# EAGLE design semistatic (EAGLE 9.6.2)
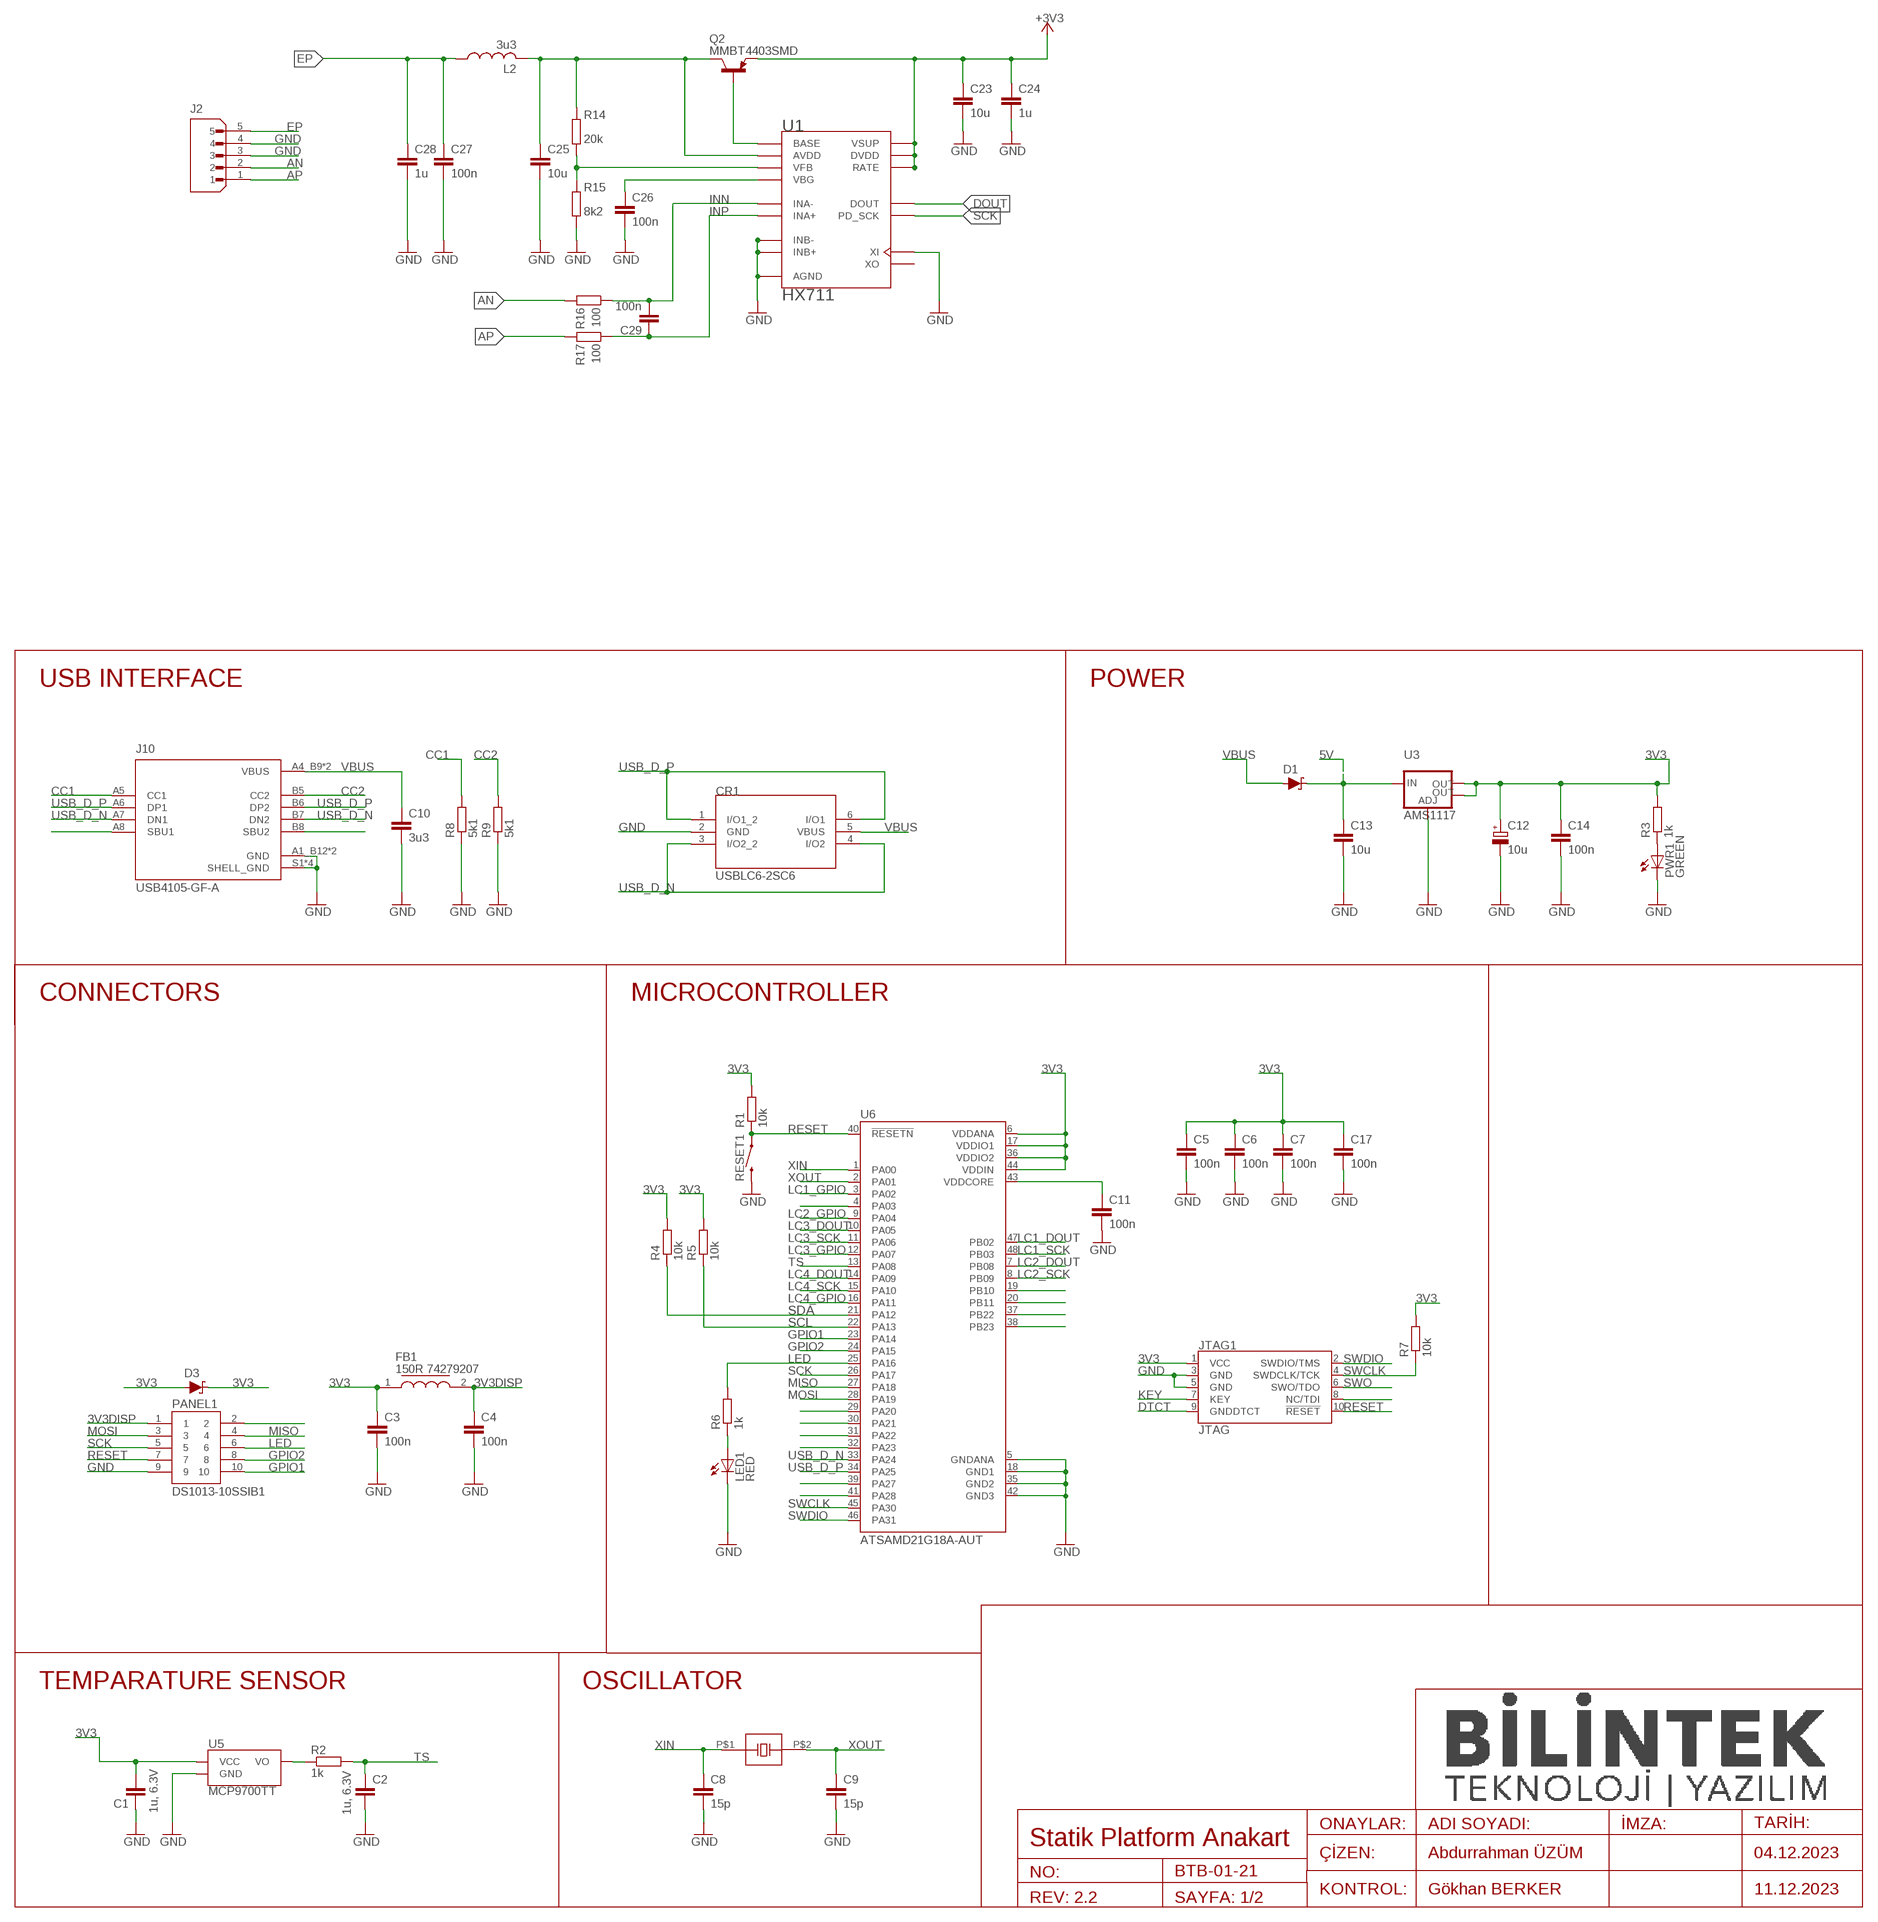
[diagram p0: schematic, sheet 1, part 1 of 2]
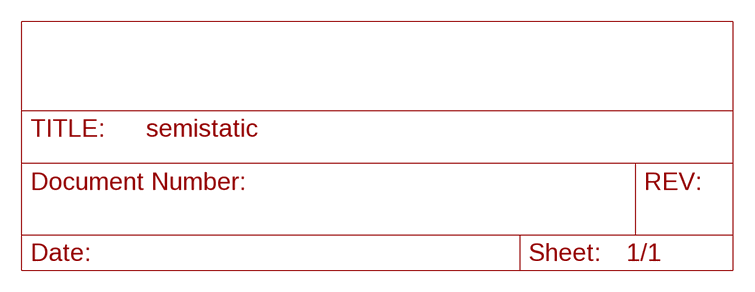
[diagram p1: schematic, sheet 1, part 2 of 2]

## Parts
C1  1u, 6.3V  C-EUC0603  [C0603]
C2  1u, 6.3V  C-EUC0603  [C0603]
C3  100n  C-EUC0603  [C0603]
C4  100n  C-EUC0603  [C0603]
C5  100n  C-EUC0603  [C0603]
C6  100n  C-EUC0603  [C0603]
C7  100n  C-EUC0603  [C0603]
C8  15p  C-EUC0603  [C0603]
C9  15p  C-EUC0603  [C0603]
C10  3u3  C-EUC0603K  [C0603K]
C11  100n  C-EUC0603  [C0603]
C12  10u  CPOL-EUD  [PANASONIC_D]
C13  10u  C-EUC0603  [C0603]
C14  100n  C-EUC0603  [C0603]
C17  100n  C-EUC0603  [C0603]
C23  10u  C-EUC0603  [C0603]
C24  1u  C-EUC0603  [C0603]
C25  10u  C-EUC0603  [C0603]
C26  100n  C-EUC0603  [C0603]
C27  100n  C-EUC0603  [C0603]
C28  1u  C-EUC0603  [C0603]
C29  100n  C-EUC0603  [C0603]
CR1  USBLC6-2SC6  [SOT23-6L_STM]
D1  3A/10V/280mV  DIODE-SCHOTTKY-BAT60A  [SOD-323]
D3  3A/10V/280mV  DIODE-SCHOTTKY-BAT60A  [SOD-323]
FB1  150R 74279207  74279207  [CAPC2012X90N]
J2  B5B-XH-A(LF)(SN)  [JST_B5B-XH-A(LF)(SN)]
J10  USB4105-GF-A  [GCT_USB4105-GF-A]
JTAG1  JTAG  CORTEX_DEBUG_SMD  [SAMTECH_FTSH-105-01]
L2  3u3  L-USL3216C  [L3216C]
LED1  RED  LEDCHIPLED_0805  [CHIPLED_0805]
PANEL1  DS1013-10SSIB1  [CONNFLY_DS1013-10SSIB1]
PWR1  GREEN  LEDCHIPLED_0805  [CHIPLED_0805]
Q2  MMBT4403SMD  [SOT23-BEC]
R1  10k  R-EU_R0603  [R0603]
R2  1k  R-EU_R0603  [R0603]
R3  1k  R-EU_R0603  [R0603]
R4  10k  R-EU_R0603  [R0603]
R5  10k  R-EU_R0603  [R0603]
R6  1k  R-EU_R0603  [R0603]
R7  10k  R-EU_R0603  [R0603]
R8  5k1  R-EU_R0603  [R0603]
R9  5k1  R-EU_R0603  [R0603]
R14  20k  R-EU_R0603  [R0603]
R15  8k2  R-EU_R0603  [R0603]
R16  100  R-EU_R0603  [R0603]
R17  100  R-EU_R0603  [R0603]
RESET1  MOMENTARY-SWITCH-SPST-SMD-6.0X3.5MM  [TACTILE_SWITCH_SMD_6.0X3.5MM]
U1  HX711  [SOP127P600X180-16N]
U3  AMS1117  V_REG_LM1117SOT223  [SOT223]
U5  MCP9700TT  [SOT23-3]
U6  ATSAMD21G18A-AUT  [QFP50P900X900X120-48N]
Y2  32728  CRYSTALSAMD  [CRYSTALSAMD]

## Nets
3V3: C1.2 C3.1 C5.1 C6.1 C7.1 C12.+ C14.1 C17.1 D3.A D3.C FB1.1 JTAG1.1(VCC) R1.2 R3.2 R4.2 R5.2 R7.2 U3.2(OUT) U3.4(OUT) U5.1(VCC) U6.6(VDDANA) U6.17(VDDIO1) U6.36(VDDIO2) U6.44(VDDIN)
3V3DISP: C4.1 FB1.2 PANEL1.1
5V: C13.1 D1.C U3.3(IN)
+3V3: C23.1 C24.1 Q2.E U1.1(VSUP) U1.15(RATE) U1.16(DVDD)
AN: J2.2 R16.2
AP: J2.1 R17.2
AVDD1: C25.1 L2.2 Q2.C R14.1 U1.3(AVDD)
BASE1: Q2.B U1.2(BASE)
CC1: J10.A5(CC1) R8.2
CC2: J10.B5(CC2) R9.2
DOUT: U1.12(DOUT)
DTCT: JTAG1.9(GNDDTCT)
EP: C27.1 C28.1 J2.5 L2.1
GND: C1.1 C2.2 C3.2 C4.2 C5.2 C6.2 C7.2 C8.2 C9.2 C10.2 C11.2 C12.- C13.2 C14.2 C17.2 C23.2 C24.2 C25.2 C26.2 C27.2 C28.2 CR1.2(GND) J2.3 J2.4 J10.A1_B12(GND) J10.B1_A12(GND) J10.S1(SHELL_GND) J10.S2(SHELL_GND) J10.S3(SHELL_GND) J10.S4(SHELL_GND) JTAG1.3(GND) JTAG1.5(GND) LED1.C PANEL1.9 PWR1.C R8.1 R9.1 R15.2 RESET1.2 U1.5(AGND) U1.9(INB-) U1.10(INB+) U1.14(XI) U3.1(ADJ) U5.3(GND) U6.5(GNDANA) U6.18(GND1) U6.35(GND2) U6.42(GND3)
GPIO1: PANEL1.10 U6.23(PA14)
GPIO2: PANEL1.8 U6.24(PA15)
INN: C29.2 R16.1 U1.7(INA-)
INP: C29.1 R17.1 U1.8(INA+)
KEY: JTAG1.7(KEY)
LC1_DOUT: U6.47(PB02)
LC1_GPIO: U6.3(PA02)
LC1_SCK: U6.48(PB03)
LC2_DOUT: U6.7(PB08)
LC2_GPIO: U6.9(PA04)
LC2_SCK: U6.8(PB09)
LC3_DOUT: U6.10(PA05)
LC3_GPIO: U6.12(PA07)
LC3_SCK: U6.11(PA06)
LC4_DOUT: U6.14(PA09)
LC4_GPIO: U6.16(PA11)
LC4_SCK: U6.15(PA10)
LED: PANEL1.6 R6.2 U6.25(PA16)
LED_GP2: LED1.A R6.1
LED_PWR1: PWR1.A R3.1
MISO: PANEL1.4 U6.27(PA18)
MOSI: PANEL1.3 U6.28(PA19)
N$4: R2.1 U5.2(VO)
N$5: U6.4(PA03)
N$6: U6.29(PA20)
N$10: U6.39(PA27)
N$11: U6.41(PA28)
N$12: U6.19(PB10)
N$13: U6.20(PB11)
N$14: U6.37(PB22)
N$15: U6.38(PB23)
N$16: J10.A8(SBU1)
N$17: J10.B8(SBU2)
N$18: JTAG1.8(NC/TDI)
N$21: PANEL1.2
N$22: U6.30(PA21)
N$23: U6.31(PA22)
N$25: U6.32(PA23)
RESET: JTAG1.10(!RESET) PANEL1.7 R1.1 RESET1.1 U6.40(!RESETN)
SCK: PANEL1.5 U1.11(PD_SCK) U6.26(PA17)
SCL: R5.1 U6.22(PA13)
SDA: R4.1 U6.21(PA12)
SWCLK: JTAG1.4(SWDCLK/TCK) R7.1 U6.45(PA30)
SWDIO: JTAG1.2(SWDIO/TMS) U6.46(PA31)
SWO: JTAG1.6(SWO/TDO)
TS: C2.1 R2.2 U6.13(PA08)
USB_D_N [usbpair]: CR1.3(I/O2_2) CR1.4(I/O2) J10.A7(DN1) J10.B7(DN2) U6.33(PA24)
USB_D_P [usbpair]: CR1.1(I/O1_2) CR1.6(I/O1) J10.A6(DP1) J10.B6(DP2) U6.34(PA25)
VBG1: C26.1 U1.6(VBG)
VBUS: C10.1 CR1.5(VBUS) D1.A J10.A4_B9(VBUS) J10.B4_A9(VBUS)
VDDCORE1: C11.1 U6.43(VDDCORE)
VFB1: R14.2 R15.1 U1.4(VFB)
XIN: C8.1 U6.1(PA00) Y2.P$1(XIN)
XOUT: C9.1 U6.2(PA01) Y2.P$2(XOUT)
Unconnected: U1.13(XO)

## Notes on the sheet
- USB INTERFACE | POWER
- CONNECTORS | MICROCONTROLLER
- TEMPARATURE SENSOR | OSCILLATOR
- ONAYLAR: | ADI SOYADI: | İMZA: | TARİH:
- Statik Platform Anakart
- ÇİZEN: | Abdurrahman ÜZÜM | 04.12.2023
- NO: | BTB-01-21
- KONTROL: | Gökhan BERKER | 11.12.2023
- REV: 2.2 | SAYFA: 1/2

## Library data of the parts
C1-C11 C13 C14 C17 C23-C29 = rcl:C-EU: CAPACITOR, European symbol; SPICEPREFIX: C
C12 = rcl:CPOL-EU: POLARIZED CAPACITOR, European symbol; SPICEPREFIX: C
CR1 = usblc6:USBLC6-2SC6; COPYRIGHT: Copyright (C) 2023 Ultra Librarian. All rights reserved.; MANUFACTURER_PART_NUMBER: USBLC6-2SC6; MFR_NAME: STMicroelectronics
D1 D3 = SparkFun-DiscreteSemi:DIODE-SCHOTTKY: Schottky diode A Schottky diode is a semiconductor diode which has a low forward voltage drop and a very fast switching action.; PROD_ID: DIO-14072
FB1 = FB_74279207:74279207: SMD EMI Suppression Ferrite Beads WE-CBF Source: Datasheet; DESCRIPTION: SMD EMI Suppression Ferrite Beads WE-CBF; HEIGHT: 0.9mm; MANUFACTURER_NAME: Wurth Elektronik; MANUFACTURER_PART_NUMBER: 74279207; MOUSER_PART_NUMBER: 710-74279207; MOUSER_PRICE-STOCK: https://www.mouser.co.uk/ProductDetail/Wurth-Elektronik/74279207?qs=Wn16VcyqZWrAx3dDPZmCbQ%3D%3D
J2 = B5B-XH-A_LF__SN_:B5B-XH-A(LF)(SN): Check availability <https://pricing.snapeda.com/parts/B5B-XH-A%28LF%29%28SN%29/JST%20Sales%20America%20Inc./view-part?ref=eda>; AVAILABILITY: In Stock; DESCRIPTION: Connector Header Through Hole 5 position 0.098 (2.50mm); MF: JST Sales America Inc.; MP: B5B-XH-A(LF)(SN); PACKAGE: None; PRICE: None; PURCHASE-URL: https://pricing.snapeda.com/search/part/B5B-XH-A(LF)(SN)/?ref=eda
J10 = USB4105-GF-A:USB4105-GF-A: USB-C (USB TYPE-C) USB 2.0 Receptacle Connector 24 (16+8 Dummy) Position Surface Mount, Right Angle; Through Hole Check availability <https://pricing.snapeda.com/parts/USB4105-GF-A/GCT/view-part?ref=eda>; AVAILABILITY: In Stock; DESCRIPTION: USB-C (USB TYPE-C) USB 2.0 Receptacle Connector 24 (16+8 Dummy) Position Surface Mount, Right Angle; Through Hole; MF: GCT; MP: USB4105-GF-A; PACKAGE: None; PRICE: None; PURCHASE-URL: https://pricing.snapeda.com/search?q=USB4105-GF-A&ref=eda
JTAG1 = SparkFun-Connectors:CORTEX_DEBUG: Cortex Debug Connector - 10 pin Supports JTAG debug, Serial Wire debug, and Serial Wire Viewer. PTH and SMD connector options available. General Connector Information <http://infocenter.arm.com/help/topic/com.arm.doc.faqs/attached/13634/cortex_debug_connectors.pdf> Products: PTH Connector <http://www.digikey.com/product-detail/en/cnc-tech/3220-10-0100-00/1175-1627-ND/3883661> -via Digi-Key SparkFun PSoc <https://www.sparkfun.com/products/13229> SparkFun T <https://www.sparkfun.com/products/13810>
L2 = rcl:L-US: INDUCTOR, American symbol; SPICEPREFIX: L
LED1 PWR1 = adafruit:LED: LED OSRAM: - CHIPLED LG R971, LG N971, LY N971, LG Q971, LY Q971, LO R971, LY R971 LH N974, LH R974 LS Q976, LO Q976, LY Q976 LO Q996 - Hyper CHIPLED LW Q18S LB Q993, LB Q99A, LB R99A - SideLED LS A670, LO A670, LY A670, LG A670, LP A670 LB A673, LV A673, LT A673, LW A673 LH A674 LY A675 LS A676, LA A676, LO A676, LY A676, LW A676 LS A679, LY A679, LG A679 - Hyper Micro SIDELED® LS Y876, LA Y876, LO Y876, LY Y876 LT Y87S - SmartLED LW L88C, LW L88S LB L89C, LB L89S, LG L890 LS L89K, LO L89K, LY L89K LS L896, LA L896, LO L896, LY L896 - TOPLED LS T670, LO T670, LY T670, LG T670, LP T670 LSG T670, LSP T670, LSY T670, LOP T670, LYG T670 LG T671, LOG T671, LSG T671 LB T673, LV T673, LT T673, LW T673 LH T674 LS T676, LA T676, LO T676, LY T676, LB T676, LH T676, LSB T676, LW T676 LB T67C, LV T67C, LT T67C, LS T67K, LO T67K, LY T67K, LW E67C LS E67B, LA E67B, LO E67B, LY E67B, LB E67C, LV E67C, LT E67C LW T67C LS T679, LY T679, LG T679 LS T770, LO T770, LY T770, LG T770, LP T770 LB T773, LV T773, LT T773, LW T773 LH T774 LS E675, LA E675, LY E675, LS T675 LS T776, LA T776, LO T776, LY T776, LB T776 LHGB T686 LT T68C, LB T68C - Hyper Mini TOPLED® LB M676 - Mini TOPLED Santana® LG M470 LS M47K, LO M47K, LY M47K Source: http://www.osram.convergy.de/
PANEL1 = IDC_CON_DS1013-10SSIB1:DS1013-10SSIB1: Socket; IDC; male; PIN: 10; straight; THT; gold-plated; 2.54mm Check availability <https://pricing.snapeda.com/parts/DS1013-10SSIB1/Connfly/view-part?ref=eda>; AVAILABILITY: Not in stock; DESCRIPTION: Socket; IDC; male; PIN: 10; straight; THT; gold plated; 2.54mm; MF: Connfly; MP: DS1013-10SSIB1; PACKAGE: None; PRICE: None
Q2 = MMBT4403_:MMBT4403*: PNP Transistror Check availability <https://pricing.snapeda.com/parts/MMBT4403/ON%20Semiconductor/view-part?ref=eda>; AVAILABILITY: In Stock; DESCRIPTION: Bipolar (BJT) Transistor PNP 40 V 600 mA 200MHz 150 mW Surface Mount SC-70-3 (SOT323); MF: ON Semiconductor; MP: MMBT4403; PACKAGE: SOT-23-3 ON Semiconductor; PRICE: None; PURCHASE-URL: https://pricing.snapeda.com/search/part/MMBT4403/?ref=eda
R1-R9 R14-R17 = rcl:R-EU_: RESISTOR, European symbol; SPICEPREFIX: R
RESET1 = SparkFun-Switches:MOMENTARY-SWITCH-SPST: Momentary Switch (Pushbutton) - SPST Normally-open (NO) SPST momentary switches (buttons, pushbuttons). Variants PTH-12MM - 12mm square, through-hole Momentary Pushbutton Switch - 12mm Square <https://www.sparkfun.com/products/9190> (COM-09190) PTH-6.0MM, PTH-6.0MM-KIT - 6.0mm square, through-hole Mini Pushbutton Switch <https://www.sparkfun.com/products/97> (COM-00097) KIT package intended for soldering kit's - only one side of pads' copper is exposed. PTH-RIGHT-ANGLE-KIT - Right-angle, through-hole Right Angle Tactile Button <https://www.sparkfun.com/products/10791> - Used on SparkFun BigTime Watch Kit <https://www.sparkfun.com/products/11734> SMD-12MM - 12mm square, surface-mount Tactile Button - SMD (12mm) <https://www.sparkfun.com/products/12993> (COM-12993) Used on SparkFun PicoBoard <https://www.sparkfun.com/products/11888> SMD-4.5MM - 4.5mm Square Trackball Switch Used on SparkFun Blackberry Trackballer Breakout <https://www.sparkfun.com/products/13169> SMD-4.6MMX2.8MM - 4.60mm x 2.80mm, surface mount Used on SparkFun Pro Micro - RP2040 <https://www.sparkfun.com/products/17717> SMD-5.2MM, SMD-5.2-REDUNDANT - 5.2mm square, surface-mount Mini Pushbutton Switch - SMD <https://www.sparkfun.com/products/8720> (COM-08720) Used on Arduino Pro Mini <https://www.sparkfun.com/products/11114> REDUNDANT package connects both switch circuits together SMD-6.0X3.5MM - 6.0 x 3.5mm, surface mount Momentary Reset Switch SMD <https://www.sparkfun.com/products/8229> (COM-08229) SMD-6.2MM-TALL - 6.2mm square, surface mount Tactile Button - SMD (6mm) <https://www.sparkfun.com/products/12992> Used on SparkFun Digital Sandbox <https://www.sparkfun.com/products/12651> SMD-RIGHT-ANGLE - Right-angle, surface mount Used on SparkFun Block for Intel® Edison - Arduino <https://www.sparkfun.com/products/13036>; PROD_ID: SWCH-14278; SF_SKU: COM-08229
U1 = HX711:HX711: Check availability <https://pricing.snapeda.com/parts/HX711/AVIA%20SEMICONDUCTOR/view-part?ref=eda>; AVAILABILITY: Not in stock; DESCRIPTION: Precision 24-bit analog-to-digital converter (ADC) designed for weigh scales and industrial control applications to interface directly with a bridge sensor.; MF: AVIA SEMICONDUCTOR; MP: HX711; PACKAGE: None; PRICE: None
U3 = SparkFun-IC-Power:V_REG_LM1117: Voltage Regulator LM1117 Standard adjustable voltage regulator but in SMD form. Spark Fun Electronics SKU : COM-00595; PROD_ID: VREG-08170
U5 = SparkFun-Sensors:MCP9700: Microchip MCP9700 Analog-Output Temperature Sensor The MCP9700 can accurately measure temperature from -40C to +150C. The output of the MCP9700 is calibrated to a slope of 10mV/°C and has a DC offset of 500mV. The offset allows reading negative temperatures without the need for a negative supply. Datasheet <http://ww1.microchip.com/downloads/en/DeviceDoc/20001942F.pdf> SparkFun Products LilyPad Temperature Sensor <https://www.sparkfun.com/products/8777> (DEV-08777) SparkFun Digital Sandbox <https://www.sparkfun.com/products/12651> (DEV-12651); PROD_ID: IC-08917
U6 = ATSAMD21G18A-AUT:ATSAMD21G18A-AUT: Cortex-M0+, 256KB FLASH, 32KB SRAM, USB, DMA, T&R - 48TQFP IND TEMP, GREEN, 1.6-3.6V, 48MHz Check availability <https://pricing.snapeda.com/parts/ATSAMD21G18A-AUT/Microchip/view-part?ref=eda>; AVAILABILITY: In Stock; DESCRIPTION: ARM® Cortex®-M0+ SAM D21G, Functional Safety (FuSa) Microcontroller IC 32-Bit Single-Core 48MHz 256KB (256K x 8) FLASH 48-TQFP (7x7); MF: Microchip; MP: ATSAMD21G18A-AUT; PACKAGE: TQFP-48 Microchip; PRICE: None; PURCHASE-URL: https://pricing.snapeda.com/search?q=ATSAMD21G18A-AUT&ref=eda
Y2 = crystalsamd:CRYSTALSAMD

## Net classes
1 usbpair: width 0.25 mm, clearance 0.2 mm

## Board
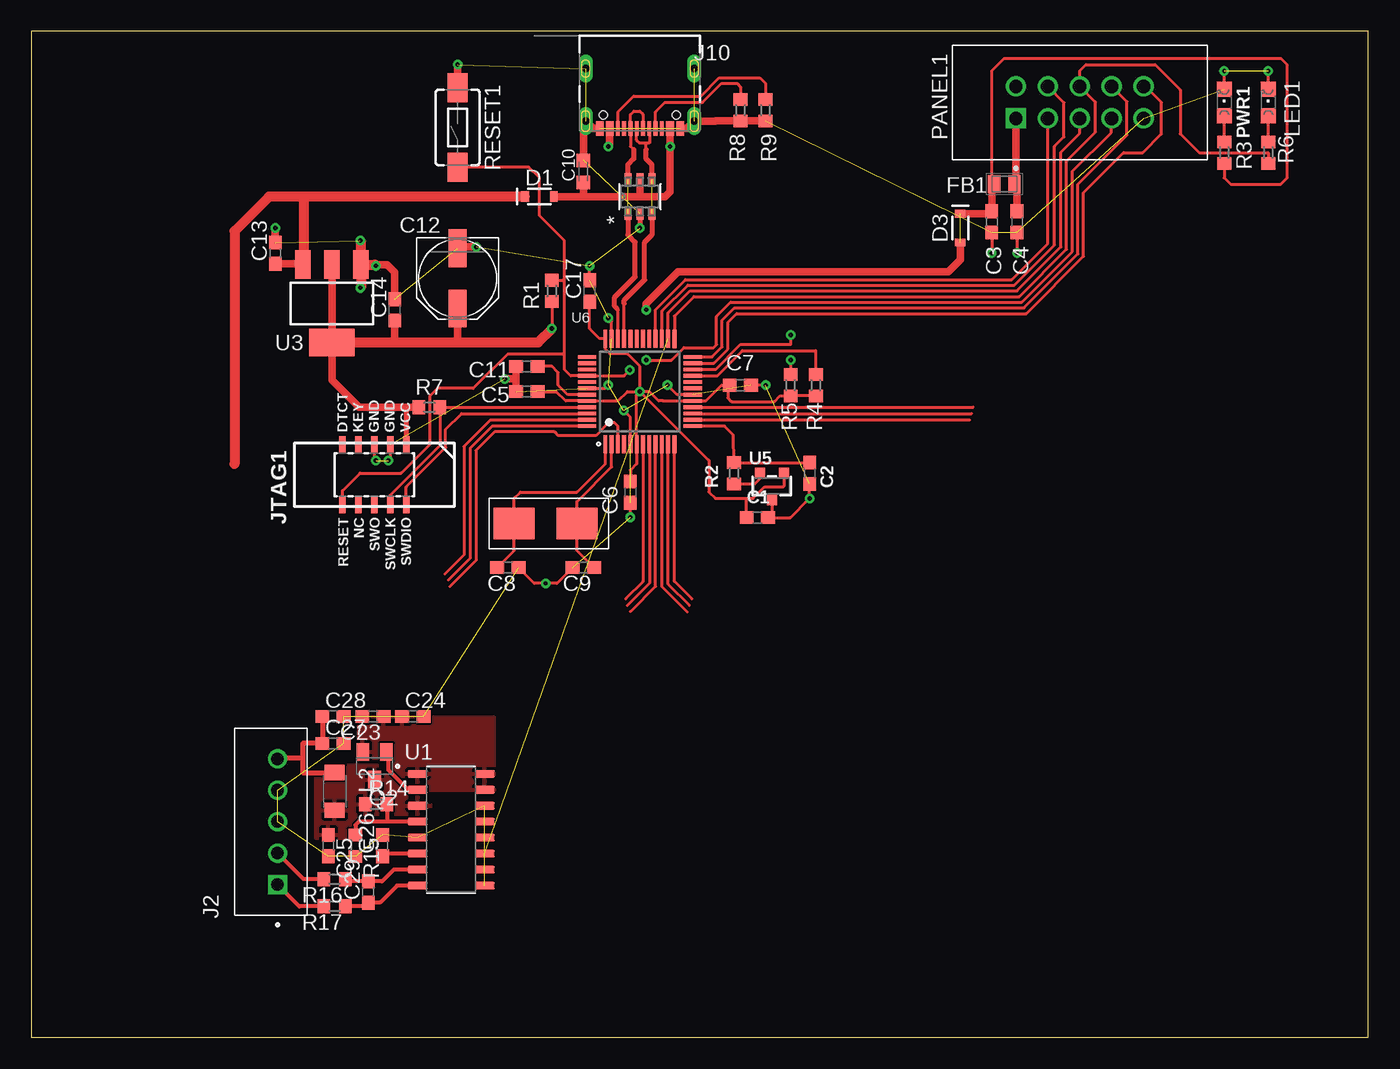
[diagram p2: board, top side]
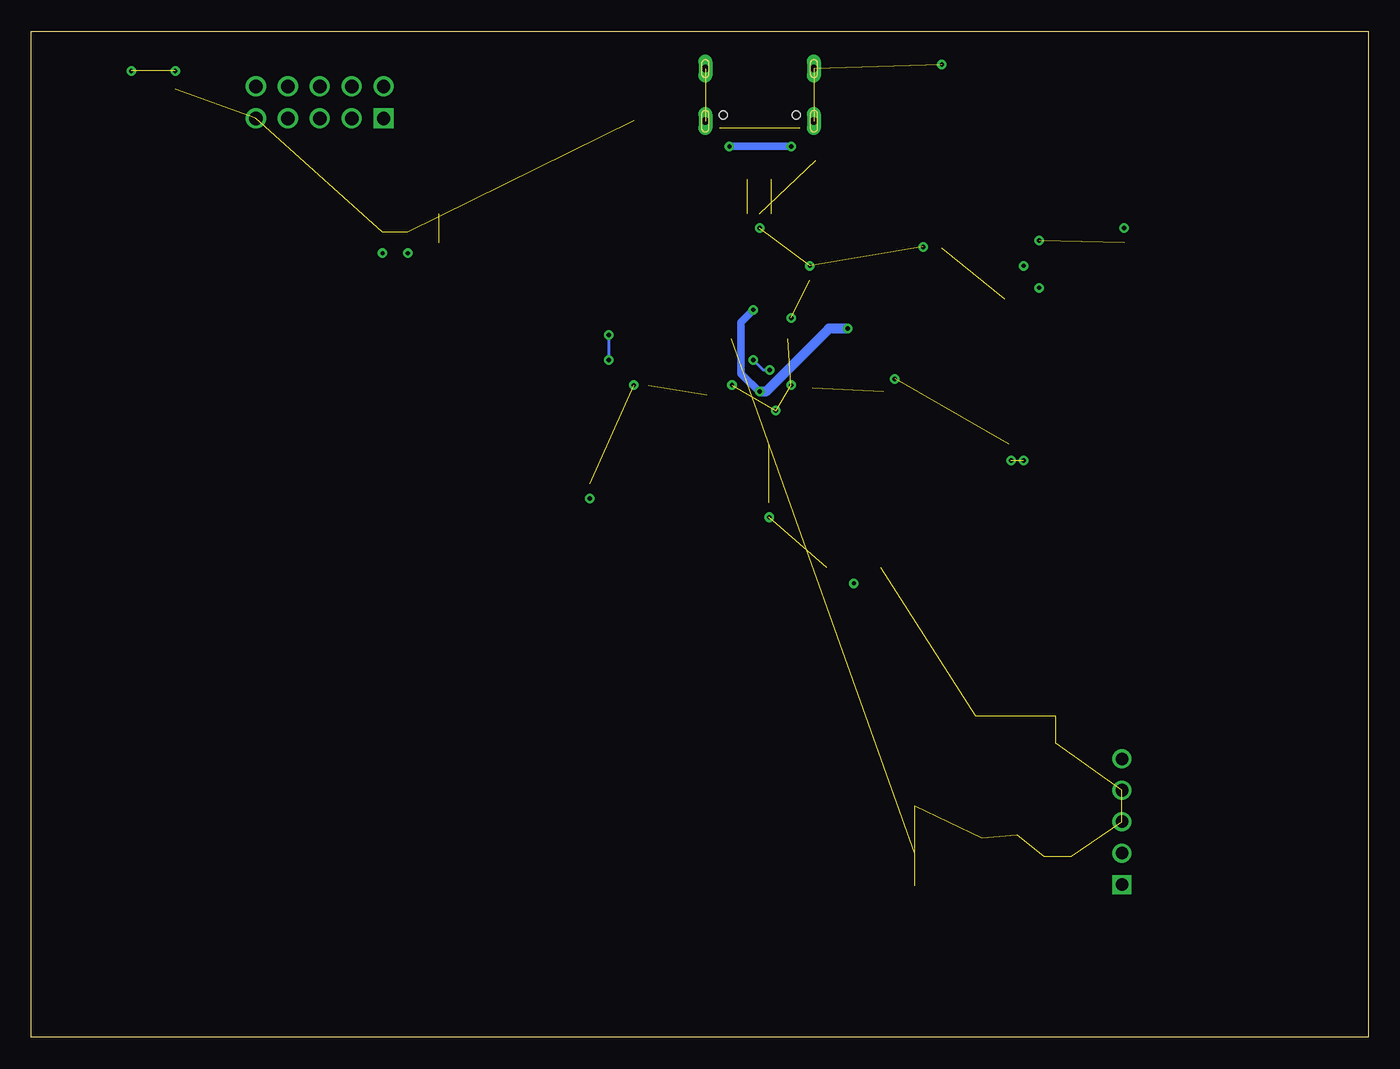
[diagram p3: board, bottom side, seen from below]

Size 106.35 x 80 mm. Coordinates in mm from the lower left corner, seen from the top.
Outline: 0,0 106.35,0 106.35,80 0,80 0,0
Copper layers (1*16): Top 0.035mm / dielectric 1.5mm / Bottom 0.035mm
Design rules "default": minimum track width 6mil, minimum drill 0.35mm, track to track 6mil, track to pad 6mil, pad to pad 6mil, via to via 6mil, smd to smd 6mil, copper to edge 40mil, drill to drill 6mil, minimum pad ring 10mil, minimum via ring 8mil, stop-mask expansion 4mil, vias tented up to drill 0mil, thermal gap 10mil
bRestrict: 7 lines

### Footprints (pad centres in the part's own frame; a part is rotated, then mirrored left to right if it is on the bottom)
C0603 = smd 1.1 x 1: 1 -0.85,0; 2 0.85,0
C0603K = smd 1.05 x 1.08: 1 -0.875,0; 2 0.875,0
PANASONIC_D = smd 3 x 1.4: + 2.4,0; - -2.4,0
SOT23-6L_STM = smd 0.978 x 0.559: 1 -1.365,0.95; 2 -1.365,0; 3 -1.365,-0.95; 4 1.365,-0.95; 5 1.365,0; 6 1.365,0.95
SOD-323 = smd 0.63 x 0.83: A 1.15,0; C -1.15,0
CAPC2012X90N = smd 0.96 x 1.39: 1 -0.81,0; 2 0.81,0
JST_B5B-XH-A(LF)(SN) = drill 1 square: 1 -5,-0.525 | drill 1: 2 -2.5,-0.525; 3 0,-0.525; 4 2.5,-0.525; 5 5,-0.525
GCT_USB4105-GF-A = smd 0.6 x 1.15: A1_B12 -3.2,4.755; A4_B9 -2.4,4.755; B1_A12 3.2,4.755; B4_A9 2.4,4.755 | smd 0.3 x 1.15: A5 -1.25,4.755; A6 -0.25,4.755; A7 0.25,4.755; A8 1.25,4.755; B5 1.75,4.755; B6 0.75,4.755; B7 -0.75,4.755; B8 -1.75,4.755 | drill 0.6 pad 1.05 long: S1 -4.32,4.18; S4 4.32,4.18 | drill 0.6 pad 1 long: S2 -4.32,0; S3 4.32,0 | hole 0.65: -2.9,3.68; 2.9,3.68
SAMTECH_FTSH-105-01 = smd 0.508 x 1.27: 1 -2.54,-2.413; 2 -2.54,2.413; 3 -1.27,-2.413; 4 -1.27,2.413; 5 0,-2.413; 6 0,2.413; 7 1.27,-2.413; 8 1.27,2.413; 9 2.54,-2.413; 10 2.54,2.413
L3216C = smd 1.2 x 1.6: 1 -1.5,0; 2 1.5,0
CHIPLED_0805 = smd 1.2 x 1.2: A 0,-1.05; C 0,1.05
CONNFLY_DS1013-10SSIB1 = drill 1.07 square: 1 -5.08,-1.27 | drill 1.07: 2 -5.08,1.27; 3 -2.54,-1.27; 4 -2.54,1.27; 5 0,-1.27; 6 0,1.27; 7 2.54,-1.27; 8 2.54,1.27; 9 5.08,-1.27; 10 5.08,1.27
SOT23-BEC = smd 1 x 1.4: B -0.95,-1.1; C 0,1.1; E 0.95,-1.1
R0603 = smd 1 x 1.1: 1 -0.85,0; 2 0.85,0
TACTILE_SWITCH_SMD_6.0X3.5MM = smd 2.3 x 1.6: 1 -3.15,0; 2 3.15,0
SOP127P600X180-16N = smd 1.58 x 0.59: 1 -2.67,4.445; 2 -2.67,3.175; 3 -2.67,1.905; 4 -2.67,0.635; 5 -2.67,-0.635; 6 -2.67,-1.905; 7 -2.67,-3.175; 8 -2.67,-4.445; 9 2.67,-4.445; 10 2.67,-3.175; 11 2.67,-1.905; 12 2.67,-0.635; 13 2.67,0.635; 14 2.67,1.905; 15 2.67,3.175; 16 2.67,4.445
SOT223 = smd 1.219 x 2.235: 1 -2.311,-3.099; 2 0,-3.099; 3 2.311,-3.099 | smd 3.6 x 2.2: 4 0,3.099
SOT23-3 = smd 0.8 x 0.9: 1 -0.95,-1; 2 0.95,-1; 3 0,1.1
QFP50P900X900X120-48N = smd 1.45 x 0.3: 1 -4.2,2.75; 2 -4.2,2.25; 3 -4.2,1.75; 4 -4.2,1.25; 5 -4.2,0.75; 6 -4.2,0.25; 7 -4.2,-0.25; 8 -4.2,-0.75; 9 -4.2,-1.25; 10 -4.2,-1.75; 11 -4.2,-2.25; 12 -4.2,-2.75; 25 4.17,-2.75; 26 4.2,-2.25; 27 4.2,-1.75; 28 4.2,-1.25; 29 4.2,-0.75; 30 4.2,-0.25; 31 4.2,0.25; 32 4.2,0.75; 33 4.2,1.25; 34 4.2,1.75; 35 4.2,2.25; 36 4.2,2.75 | smd 0.3 x 1.45: 13 -2.75,-4.2; 14 -2.25,-4.2; 15 -1.75,-4.2; 16 -1.25,-4.2; 17 -0.75,-4.2; 18 -0.25,-4.2; 19 0.25,-4.2; 20 0.75,-4.2; 21 1.25,-4.2; 22 1.75,-4.2; 23 2.25,-4.2; 24 2.75,-4.2; 37 2.75,4.2; 38 2.25,4.2; 39 1.75,4.2; 40 1.25,4.2; 41 0.75,4.2; 42 0.25,4.2; 43 -0.25,4.2; 44 -0.75,4.2; 45 -1.25,4.2; 46 -1.75,4.2; 47 -2.25,4.2; 48 -2.75,4.2
CRYSTALSAMD = smd 3.25 x 2.5: P$1 -2.5,0; P$2 2.5,0

### Placement (x,y rotation side)
C1  57.77,41.33 180 top
C2  61.91,44.86 270 top
C3  76.41,64.86 270 top
C4  78.41,64.86 270 top
C5  39.41,51.36 180 top
C6  47.66,43.36 270 top
C7  56.41,51.86 0 top
C8  37.91,37.36 0 top
C9  43.91,37.36 180 top
C10  43.91,68.86 90 top
C11  39.41,53.36 180 top
C12  33.91,60.36 270 top
C13  19.41,62.36 90 top
C14  28.91,57.86 90 top
C17  44.41,59.36 90 top
C23  27.18,25.53 180 top
C24  30.35,25.53 0 top
C25  23.62,15.24 270 top
C26  27.94,15.24 90 top
C27  24,23.37 0 top
C28  24,25.53 0 top
C29  26.8,11.56 90 top
CR1  48.41,66.86 90 top
D1  40.41,66.86 0 top
D3  73.91,64.36 270 top
FB1  77.41,67.86 0 top
J2  19.05,17.14 90 top
J10  48.41,77.04 180 top
JTAG1  27.29,44.74 180 top
L2  24.13,19.56 270 top
LED1  98.41,74.36 0 top
PANEL1  83.41,74.36 0 top
PWR1  94.91,74.36 0 top
Q2  27.3,21.59 180 top
R1  41.41,59.36 270 top
R2  55.91,44.86 90 top
R3  94.91,70.36 270 top
R4  62.41,51.86 270 top
R5  60.41,51.86 270 top
R6  98.41,70.36 270 top
R7  31.66,50.11 180 top
R8  56.41,73.73 90 top
R9  58.41,73.73 90 top
R14  27.43,18.54 0 top
R15  25.78,15.24 270 top
R16  24.13,12.57 180 top
R17  24.13,10.41 180 top
RESET1  33.91,72.36 90 top
U1  33.4,16.51 0 top
U3  23.91,58.36 180 top
U5  58.91,43.86 180 top
U6  48.41,51.36 90 top
Y2  40.91,40.86 0 top

### Tracks (layer width: path | path; a pad name or v marks a point on that pad's centre or on a via)
3V3  (via drill 0.35)  (1 unrouted)
  Top 0.25: C6.1 47.66,45.11 48.16,45.61 U6.6 48.16,51.11 v48.41,51.36 | U6.17 53.66,50.61 54.91,51.86 C7.1 55.41,51.71 55.41,50.86 55.71,50.56 59.11,50.56 59.56,51.01 R5.2 R4.2 | C5.1 41.76,51.36 42.51,50.61 U6.44 46.66,50.61 47.41,51.36 v48.41,51.36 | 56.91,42.86 54.41,42.86 53.91,43.36 53.91,45.9 53.87,45.9 v48.41,51.36 | 56.91,42.86 57.42,42.86 58.34,43.78 59.84,43.78 59.91,43.86 59.91,44.81 U5.1 | 50.24,50.61 49.91,50.61 49.16,51.36 v48.41,51.36 | v48.41,51.36 48.41,53.36 47.41,54.36 46.02,54.36 45.66,54.73 U6.36 45.21,55.56 44.41,56.36 C17.1 | R3.2 94.91,68.36 95.41,67.86 99.41,67.86 99.91,68.36 99.91,77.36 99.41,77.86 77.41,77.86 76.41,76.86 76.41,67.67 76.41,67.17 | C1.2 56.91,42.86 | R1.2 v41.41,56.36
  Top 0.254: 50.24,50.61 U6.17
  Top 0.406: JTAG1.1 29.83,50.11 R7.2
  Top 0.61: v48.91,57.86 48.91,58.36 51.44,60.89 72.94,60.89 73.91,61.86 D3.A | 76.41,67.17 C3.1 76.21,65.51 D3.C | 76.41,67.67 FB1.1 | U3.2 U3.4 23.91,52.26 26.06,50.11 R7.2 | C14.1 28.91,55.26 | C12.+ 33.91,55.26
  Top 0.813: U3.4 28.91,55.26 33.91,55.26 40.31,55.26 v41.41,56.36
  Bottom 0.61: v48.41,51.36 49.91,52.77 49.91,56.86 v48.91,57.86
  Bottom 0.813: v48.41,51.36 47.91,51.36 42.91,56.36 v41.41,56.36
3V3DISP
  Top 0.61: C4.1 78.41,67.67 FB1.2 78.33,67.97 PANEL1.1
5V
  Top 0.61: C13.1 21.55,61.51 U3.3
  Top 0.813: D1.C 21.66,66.86 | 21.66,66.86 21.66,61.52 U3.3 | 21.66,66.86 18.91,66.86 16.16,64.11 16.16,45.61
+3V3
  pour Top (rank 2): 36.83,19.68 36.83,25.4 26.04,25.4 26.04,22.23 27.94,22.23 30.48,19.68
AN
  Top 0.305: R16.2 21.65,12.57 J2.2
AP
  Top 0.305: R17.2 21.31,10.41 J2.1
AVDD1
  Top 0.305: U1.3 30.23,18.41 | 26.54,18.58 R14.1
  pour Top (rank 2): 31.75,19.68 29.46,19.68 27.56,21.59 22.61,21.59 22.61,15.88 25.78,15.88 25.78,17.78 31.75,17.78
BASE1
  Top 0.305: U1.2 29.96,19.68 28.38,21.26 28.38,22.56 Q2.B
CC1
  Top 0.25: J10.A5 49.66,73.61 50.41,74.36 53.41,74.36 54.91,75.86 56.16,75.86 56.41,75.61 R8.2
CC2
  Top 0.25: J10.B5 46.66,73.61 47.91,74.86 53.27,74.86 54.72,76.31 57.96,76.31 58.41,75.86 R9.2
EP
  Top 0.305: L2.1 24.03,20.95
  Top 0.406: C28.1 C27.1 21.59,23.37 21.59,22.23 | L2.1 21.59,21.06 21.59,22.23 | J2.5 19.57,22.23 21.59,22.23
GND  (via drill 0.35)  (38 unrouted)
  Top 0.25: v27.41,45.86 27.29,45.98 JTAG1.5 | v28.41,45.86 28.56,46.01 JTAG1.3 | v47.66,41.36 C6.2 | C2.2 v61.91,42.86 60.38,41.33 C1.1 58.91,41.62 U5.3 | v58.41,51.86 C7.2 | PWR1.C v94.91,76.86 | LED1.C v98.41,76.86 | C3.2 v76.41,62.36 | C4.2 v78.41,62.36 | C8.2 40.01,36.11 v40.91,36.11 41.81,36.11 C9.2 | C17.2 v44.41,61.36
  Top 0.254: U6.5 47.66,49.3 v47.12,49.84 | U6.42 45.65,51.61 v45.91,51.86 | U6.35 46.16,56.96 v45.9,57.22 | U6.18 51.37,51.11 v50.61,51.87
  Top 0.406: CR1.2 v48.41,64.36
  Top 0.6: C10.2 43.91,72.86 J10.S4 | C14.2 28.91,60.86 28.31,61.46 U3.1 | J10.S1 | C13.2 v19.41,64.36 | C11.2 38.56,52.36 | 38.56,52.36 C5.2 | 38.56,52.36 v37.66,52.36
  Top 0.61: J10.B1_A12 44.66,72.29 J10.S4 | J10.A1_B12 52.16,72.29 J10.S1 54.41,72.86 54.44,72.89 R8.1 | RESET1.2 v33.91,77.36 | C12.- 34.01,62.86 v35.41,62.86 | 56.26,72.73 R8.1 | R9.1 R8.1
  Top 0.813: U3.1 26.22,63.3 v26.16,63.36 | U3.1 27.31,61.46 v27.41,61.36 | U3.1 26.22,59.67 v26.16,59.61
GPIO1
  Top 0.25: U6.23 54.3,53.61 55.41,54.72 55.41,56.86 56.11,57.56 79.16,57.56 83.71,62.11 83.71,67.17 86.9,70.36 88.41,70.36 89.91,71.86 89.91,74.36 88.64,75.63 PANEL1.10
GPIO2
  Top 0.25: U6.24 54.16,54.11 54.96,54.91 54.96,57.05 55.93,58.01 78.97,58.01 83.26,62.3 83.26,67.86 87.16,71.76 87.16,74.42 PANEL1.8
INN
  Top 0.305: 30.23,13.34 U1.7 28.83,13.34 27.9,12.41 C29.2 24.98,12.41 R16.1
INP
  Top 0.305: 30.19,12.06 U1.8 29.08,12.06 27.73,10.71 C29.1 26.8,10.41 R17.1
LC1_DOUT
  Top 0.25: U6.47 44.19,49.09 36.5,49.09 34.41,47 34.41,38.36 32.91,36.86
LC1_GPIO
  Top 0.25: 33.3,35.86 35.36,37.92 35.36,46.67 36.85,48.16 41.61,48.16 41.91,47.86 44.91,47.86 45.91,48.86 46.41,48.86 46.66,48.61 U6.3
LC1_SCK
  Top 0.25: U6.48 36.66,48.61 34.91,46.86 34.91,38.11 33.16,36.36
LC2_DOUT
  Top 0.25: U6.7 48.66,36.25 47.27,34.86
LC2_GPIO
  Top 0.25: U6.9 49.66,35.86 47.66,33.86
LC2_SCK
  Top 0.25: 47.41,34.36 49.16,36.11 U6.8
LC3_DOUT
  Top 0.25: 52.19,33.82 50.16,35.85 U6.10
LC3_GPIO
  Top 0.25: 52.55,34.86 51.16,36.25 U6.12
LC3_SCK
  Top 0.25: 52.35,34.36 50.66,36.05 U6.11
LC4_DOUT
  Top 0.25: U6.14 74.66,49.11
LC4_GPIO
  Top 0.25: U6.16 74.93,50.11
LC4_SCK
  Top 0.25: U6.15 74.8,49.61
LED
  Top 0.25: U6.25 51.16,57.36 52.71,58.91 78.6,58.91 82.36,62.67 82.36,69.69 84.66,71.98 84.66,74.38 PANEL1.6 83.41,76.86 83.91,77.36 89.41,77.36 91.41,75.36 91.41,71.86 92.91,70.36 98.41,70.36 R6.2
LED_GP2
  Top 0.25: R6.1 LED1.A
LED_PWR1
  Top 0.25: R3.1 PWR1.A
MISO
  Top 0.25: U6.27 50.19,55.59 50.19,57.77 52.23,59.81 78.23,59.81 81.41,63 81.41,70.86 82.16,71.61 82.16,74.34 PANEL1.4
MOSI
  Top 0.25: PANEL1.3 80.87,63.13 78,60.26 52.04,60.26 49.66,57.88 U6.28
N$4
  Top 0.25: R2.1 57.56,44.01 57.96,44.41 U5.2
RESET  (via drill 0.35)
  Top 0.25: JTAG1.10 24.75,43.47 26.14,44.86 29.41,44.86 31.68,47.13 31.68,50.99 32.3,51.61 35.16,51.61 37.91,54.36 42.41,54.36 | v47.61,53.06 47.16,52.61 U6.40 42.91,52.61 42.41,53.11 42.41,54.36 | v48.91,53.86 50.91,53.86 51.91,54.86 54.27,54.86 54.51,55.1 54.51,57.34 55.64,58.46 78.79,58.46 82.81,62.49 82.81,68.86 85.91,71.96 85.91,73.05 PANEL1.7 | 42.41,54.36 42.41,60.36 | 42.41,60.36 42.41,63.36 40.41,65.36 40.41,68.36 39.56,69.21 RESET1.1 | R1.1 42.26,60.21 42.41,60.36
  Bottom 0.25: v47.61,53.06 48.11,53.06 v48.91,53.86
SCK  (1 unrouted)
  Top 0.25: U6.26 50.66,57.61 52.41,59.36 78.41,59.36 81.91,62.86 81.91,70.41 83.41,71.91 PANEL1.5
SCL  (via drill 0.35)
  Top 0.25: v60.41,55.86 60.41,55.11 56.43,55.11 54.43,53.11 U6.22 | v60.41,53.86 R5.1
  Bottom 0.25: v60.41,53.86 v60.41,55.86
SDA
  Top 0.25: U6.21 54.57,52.61 56.57,54.61 62.41,54.61 R4.1
SWCLK
  Top 0.25: U6.45 44.19,50.09 32.53,50.09 R7.1 32.51,47.1 28.56,43.15 JTAG1.4
SWDIO
  Top 0.25: JTAG1.2 29.83,43.78 32.96,46.91 32.96,48.36 34.21,49.61 U6.46
TS
  Top 0.25: U6.13 55.15,48.61 55.85,47.9 R2.2 C2.1
USB_D_N  (1 unrouted)
  Top 0.25: 47.19,55.59 U6.33 47.16,58.36 47.16,58.38 | J10.A7 48.16,71.36 48.41,71.11 48.91,71.11 | J10.B7 49.16,71.11 48.91,71.11 | 48.91,70.61 48.91,71.11
  Top 0.406: 47.16,58.36 47.16,58.61 48.78,60.23 48.78,63.23 49.36,63.81 CR1.3 | CR1.4 49.36,69.41 48.91,69.86 48.91,70.61
USB_D_P  (1 unrouted)
  Top 0.25: J10.A6 48.66,73.4 48.4,73.66 47.94,73.66 47.66,73.38 J10.B6 47.66,70.86 47.91,70.61 | U6.34 46.69,55.59 46.69,57.86 46.58,57.97
  Top 0.406: 46.58,57.97 46.41,58.13 46.41,58.86 48.03,60.48 48.03,63.23 47.46,63.81 CR1.1 | CR1.6 47.46,69.41 47.91,69.86 47.91,70.61
VBG1
  Top 0.305: U1.6 28.16,14.61 C26.1
VBUS  (via drill 0.35)
  Top 0.6: 50.81,67.26 50.41,66.86 48.41,66.86 | 48.41,66.86 CR1.5 | 48.41,66.86 43.91,66.86 | 43.91,66.86 D1.A | C10.1 43.91,66.86
  Top 0.61: J10.A4_B9 v50.81,70.86 50.81,67.26 | J10.B4_A9 46.01,70.96 v45.91,70.86
  Bottom 0.61: v45.91,70.86 v50.81,70.86
VDDCORE1
  Top 0.25: U6.43 42.66,51.11 41.91,51.86 41.91,52.86 41.41,53.36 C11.1
VFB1
  Top 0.305: U1.4 28.28,17.14 | 28.28,17.14 26.04,17.14 25.78,16.89 R15.1 | R14.2 28.28,17.14
XIN
  Top 0.25: U6.1 45.66,45.61 43.41,43.36 38.91,43.36 38.41,42.86 Y2.P$1 38.41,38.71 C8.1
XOUT
  Top 0.25: U6.2 46.16,45.36 43.41,42.61 Y2.P$2 43.41,38.71 C9.1

### Text on the board
tNames: DTCT | KEY | GND | GND | VCC | RESET | NC | SWO | SWCLK | SWDIO | Static Platform Main / v2.2 2348 AU